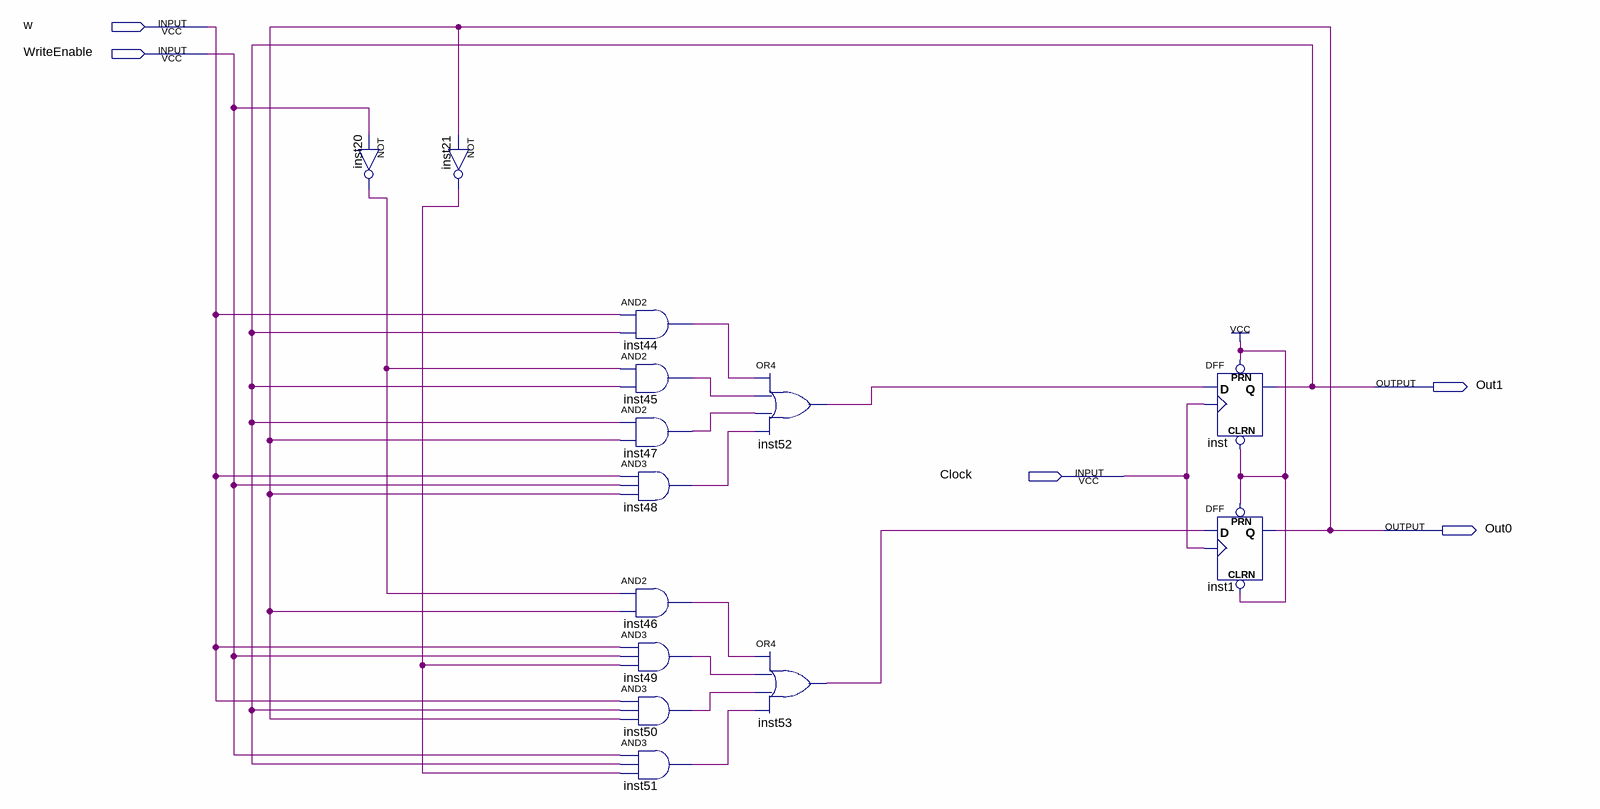
[diagram p0: schematic sheet]
// Quartus schematic upDownFSM.bdf as structural Verilog: 14 symbols, 5 pins
module upDownFSM (
  input  w,
  input  WriteEnable,
  input  Clock,
  output Out1,
  output Out0
);

  wire inst20_out, inst21_out, inst44_out, inst45_out, inst46_out, inst47_out, inst48_out, inst49_out,
       inst50_out, inst51_out, inst52_out, inst53_out;

  not inst20 (inst20_out, WriteEnable);
  not inst21 (inst21_out, Out0);
  and inst44 (inst44_out, w, Out1);
  and inst45 (inst45_out, inst20_out, Out1);
  and inst47 (inst47_out, Out1, Out0);
  and inst48 (inst48_out, w, WriteEnable, Out0);
  and inst46 (inst46_out, inst20_out, Out0);
  and inst49 (inst49_out, w, WriteEnable, inst21_out);
  and inst50 (inst50_out, w, Out1, Out0);
  and inst51 (inst51_out, WriteEnable, Out1, inst21_out);
  or inst52 (inst52_out, inst44_out, inst45_out, inst47_out, inst48_out);
  or inst53 (inst53_out, inst46_out, inst49_out, inst50_out, inst51_out);
  DFF inst (.CLRN(1'b1), .CLK(Clock), .D(inst52_out), .PRN(1'b1), .Q(Out1));
  DFF inst1 (.CLRN(1'b1), .CLK(Clock), .D(inst53_out), .PRN(1'b1), .Q(Out0));
endmodule
